# Altium schematic sheet Sheet5.SchDoc
size A
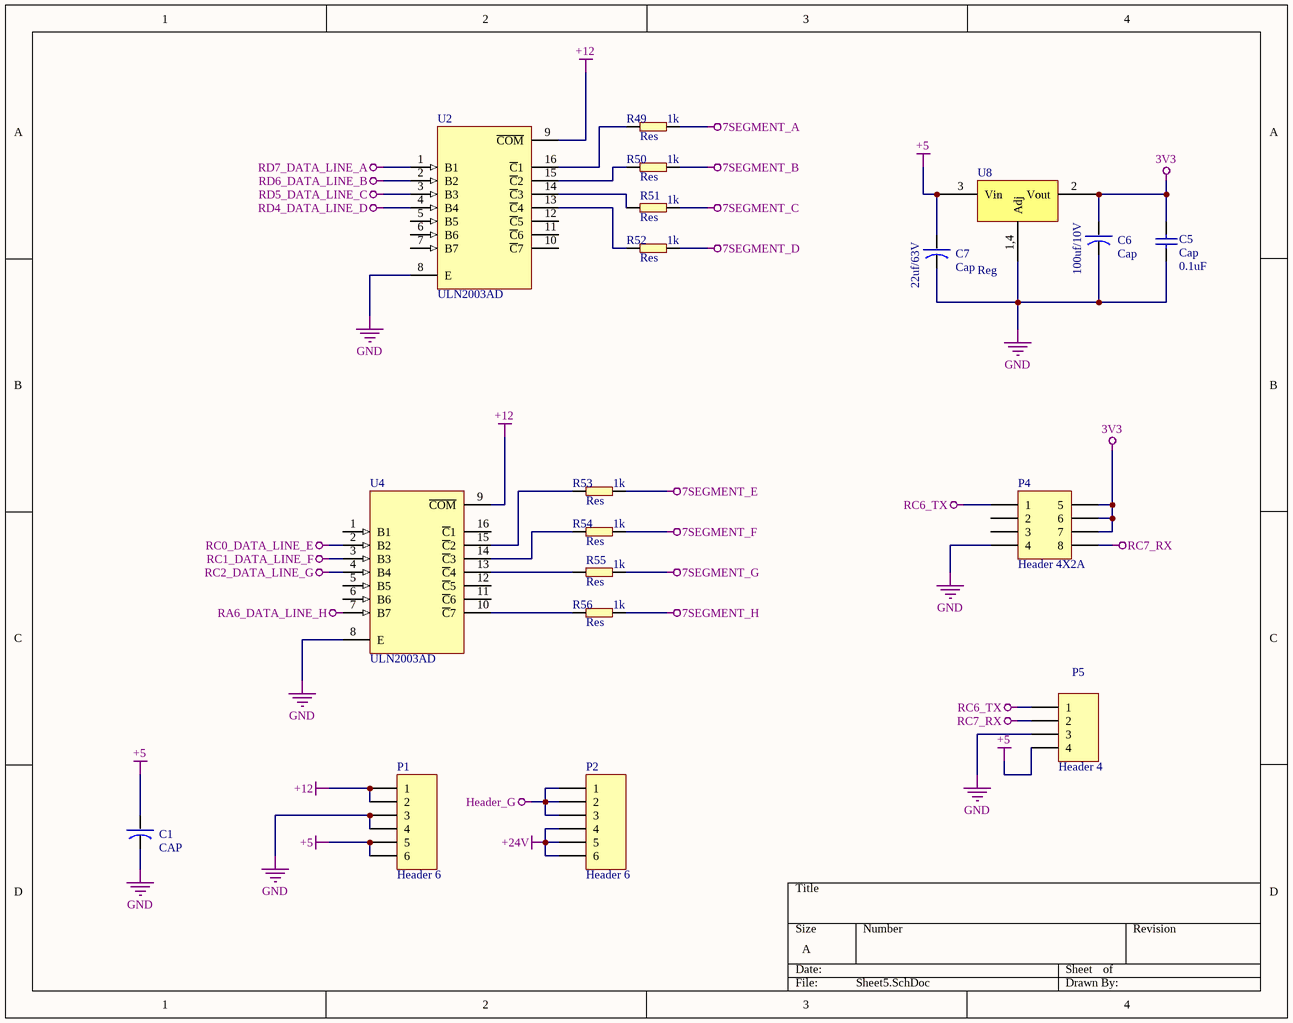
[diagram p0: Sheet5.SchDoc]

## Parts
C1  CAP  [Capacitor]
C5  Cap  [RES0805]
C6  Cap  [CAP_220uF]
C7  Cap  [CAP_220uF]
P1  Header 6  [HDR1X6]
P2  Header 6  [HDR1X6]
P4  Header 4X2A  [HDR2X4_CEN]
P5  Header 4  [HDR1X4]
R49  Res  value 1k  [RES0805]
R50  Res  value 1k  [RES0805]
R51  Res  value 1k  [RES0805]
R52  Res  value 1k  [RES0805]
R53  Res  value 1k  [RES0805]
R54  Res  value 1k  [RES0805]
R55  Res  value 1k  [RES0805]
R56  Res  value 1k  [RES0805]
U2  ULN2003AD  [D016_N]
U4  ULN2003AD  [D016_N]
U8  Reg  [LM1117]

## Nets
3V3: C5.2(A) C6.1(a) P4.5 P4.6 P4.7 U8.2(Vout)
7SEGMENT_A: R49.2(b)
7SEGMENT_B: R50.2(b)
7SEGMENT_C: R51.2(b)
7SEGMENT_D: R52.2(b)
7SEGMENT_E: R53.2(b)
7SEGMENT_F: R54.2(b)
7SEGMENT_G: R55.2(b)
7SEGMENT_H: R56.2(b)
+5: C1.1(a) C7.1(a) P1.5 P1.6 P5.4 U8.3(Vin)
+12: P1.1 P1.2 U2.9(~{COM}) U4.9(~{COM})
+24V: P2.4 P2.5 P2.6
GND: C1.2(b) C5.1(A) C6.2(b) C7.2(b) P1.3 P1.4 P4.4 P5.3 U2.8(E) U4.8(E) U8.1,4(Adj)
Header_G: P2.1 P2.2 P2.3
RA6_DATA_LINE_H: U4.7(B7)
RC0_DATA_LINE_E: U4.2(B2)
RC1_DATA_LINE_F: U4.3(B3)
RC2_DATA_LINE_G: U4.4(B4)
RC6_TX: P4.1 P5.1
RC7_RX: P4.8 P5.2
RD4_DATA_LINE_D: U2.4(B4)
RD5_DATA_LINE_C: U2.3(B3)
RD6_DATA_LINE_B: U2.2(B2)
RD7_DATA_LINE_A: U2.1(B1)
NetR49_1: R49.1(a) U2.16(~{C}1)
NetR50_1: R50.1(a) U2.15(~{C}2)
NetR51_1: R51.1(a) U2.14(~{C}3)
NetR52_1: R52.1(a) U2.13(~{C}4)
NetR53_1: R53.1(a) U4.15(~{C}2)
NetR54_1: R54.1(a) U4.14(~{C}3)
NetR55_1: R55.1(a) U4.13(~{C}4)
NetR56_1: R56.1(a) U4.10(~{C}7)

Not connected (* = marked no-connect by the designer): P4 2 3; U2 5(B5) 6(B6) 7(B7) 10(~{C}7) 11(~{C}6) 12(~{C}5); U4 1(B1) 5(B5) 6(B6) 11(~{C}6) 12(~{C}5) 16(~{C}1)

## Notes on the sheet
- (in symbol CAP_104_SMD) 0.1uF
- (in symbol CAP_220uF) 100uf/10V; 22uf/63V

## Library data of the parts
C1 = CAP_GT_SMD: 470uf
C5 = CAP_104_SMD
C6 C7 = CAP_220uF: Value: 100uf/10v
P1 P2 = Header 6: Header, 6-Pin; LatestRevisionDate: 17-Jul-2002; LatestRevisionNote: Re-released for DXP Platform.; Publisher: Altium Limited
P4 = Header 4X2A: Header, 4-Pin, Dual row; LatestRevisionDate: 17-Jul-2002; LatestRevisionNote: Re-released for DXP Platform.; Publisher: Altium Limited
P5 = Header 4: Header, 4-Pin; LatestRevisionDate: 17-Jul-2002; LatestRevisionNote: Re-released for DXP Platform.; Publisher: Altium Limited
R49-R56 = Resistor: Res0805
U2 U4 = ULN2003AD: Darlington Transistor Array; Published: 15-May-2002; LatestRevisionDate: 13-Apr-2006; LatestRevisionNote: IPC-7351 Footprint Added.; DatasheetVersion: Sep-1986; PackageVersion: Jan-1998; PackageReference: D016; Publisher: Altium Limited; PackageDescription: 16-Pin Small Outline Integrated Circuit 1.27 mm Pitch; Code_IPC: SOIC127P600-16; ComponentLink1Description: Manufacturer Link; ComponentLink1URL: http://www.ti.com/; ComponentLink2Description: Datasheet; ComponentLink2URL: http://www-s.ti.com/sc/ds/uln2002a.pdf
U8 = LM1117